# Altium schematic sheet DCDC_pump.SchDoc
size A4; SheetNumber: 5; SheetTotal: 5
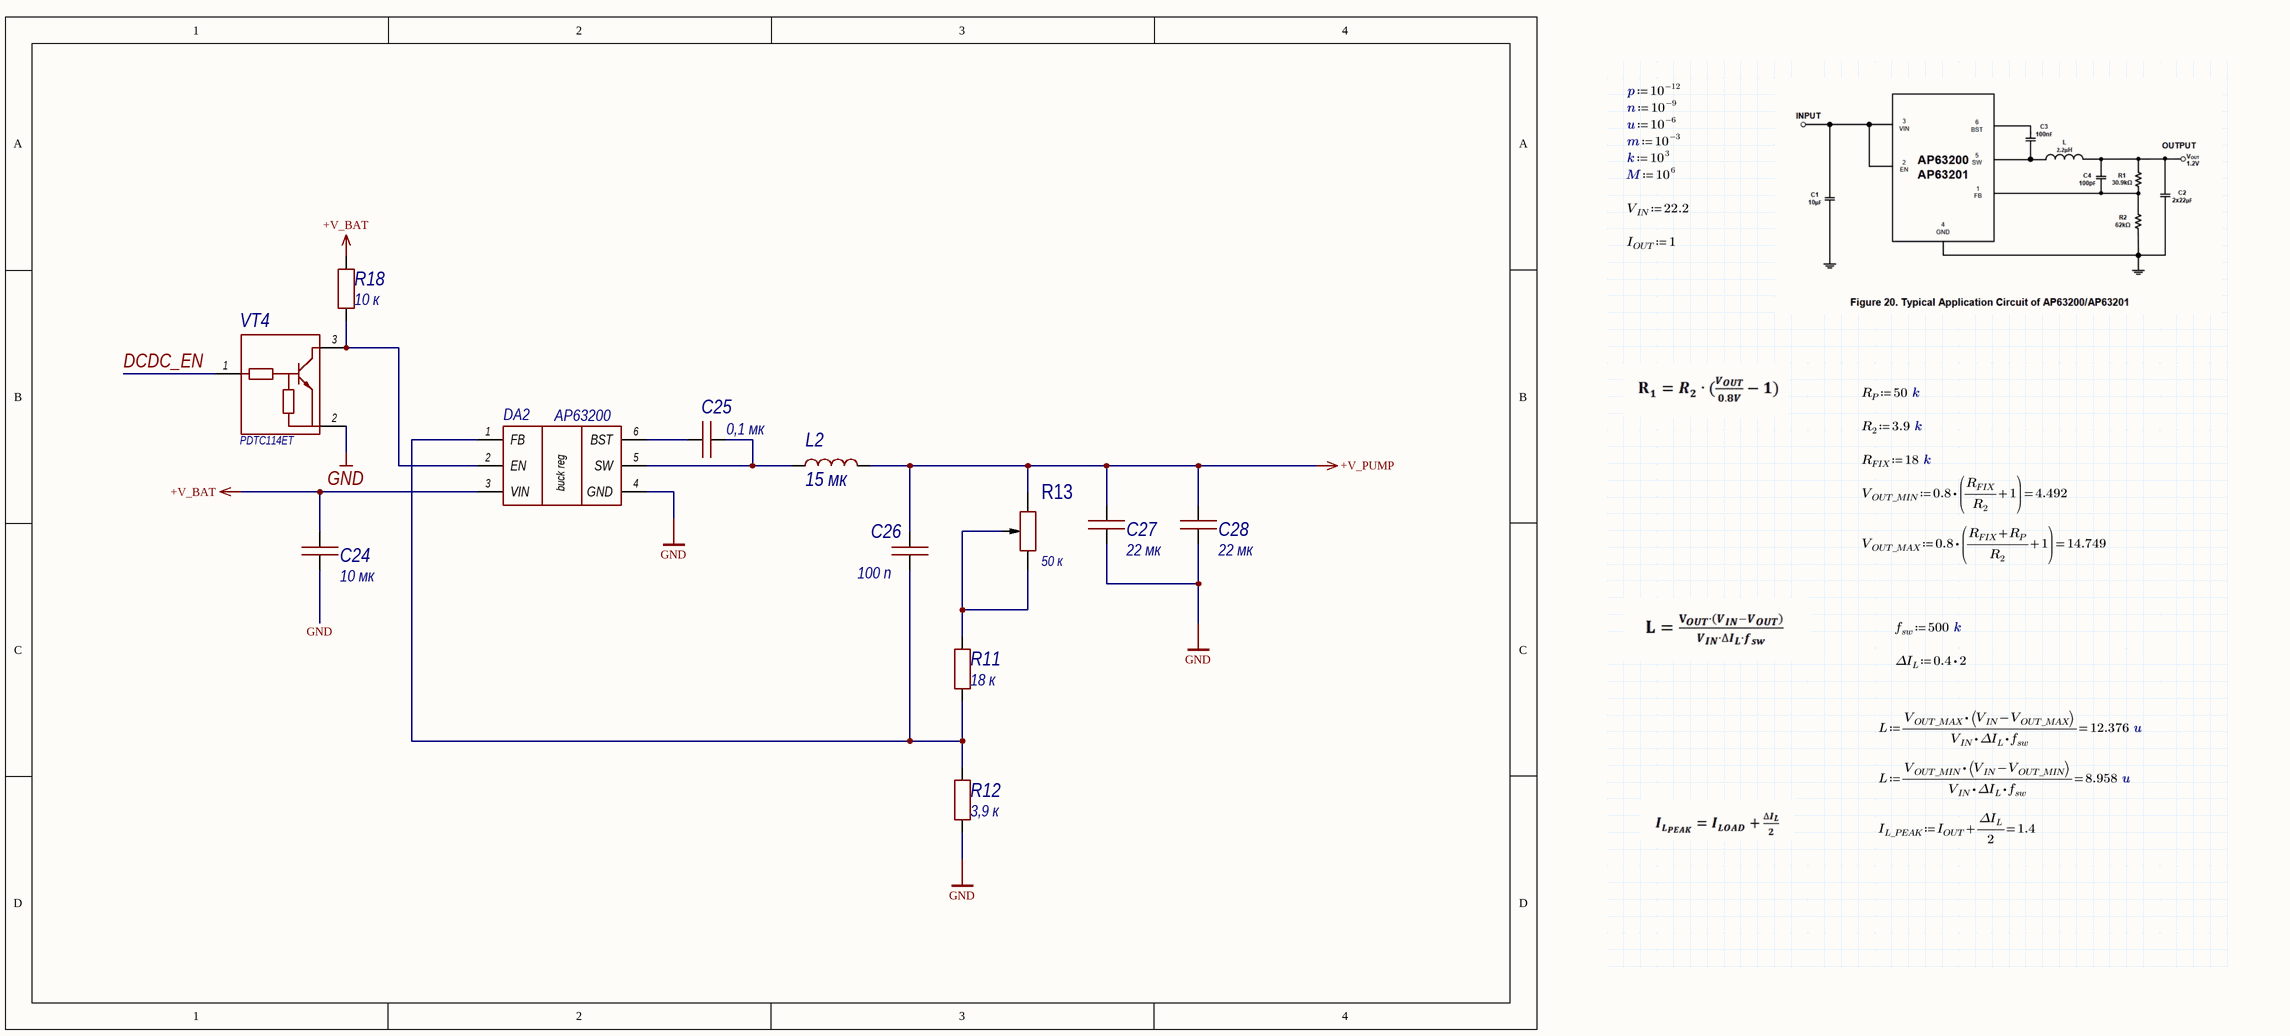
[diagram p0: DCDC_pump.SchDoc]

## Parts
C24  value 10 мк  [1210C]  (hidden comment: Capacitor)
C25  value 0,1 мк  [0603C]  (hidden comment: Capacitor)
C26  value 100 п  [0603C]  (hidden comment: Capacitor)
C27  value 22 мк  [1210C]  (hidden comment: Capacitor)
C28  value 22 мк  [1210C]  (hidden comment: Capacitor)
DA2  AP63200  [TSOT26]
L2  value 15 мк  [SP43]  (hidden comment: SP43-150K)
R11  value 18 к  [0603R]  (hidden comment: Resistor)
R12  value 3,9 к  [0603R]  (hidden comment: Resistor)
R13  value 50 к  [3mm_trim]  (hidden comment: TC33X-2-503E)
R18  value 10 к  [0603R]  (hidden comment: Resistor)
VT4  PDTC114ET  [SOT23-3]

## Nets
+V_BAT: C24.2 DA2.3(VIN) R18.2
+V_PUMP: C26.2 C27.2 C28.2 L2.2 R13.3
GND: C24.1 C27.1 C28.1 DA2.4(GND) R12.1 VT4.2(E)
DCDC_EN: VT4.1(B)
NetC25_1: C25.1 DA2.6(BST)
NetC25_2: C25.2 DA2.5(SW) L2.1
NetC26_1: C26.1 DA2.1(FB) R11.1 R12.2
NetDA2_2: DA2.2(EN) R18.1 VT4.3(C)
NetR11_2: R11.2 R13.1 R13.2

## Notes on the sheet
- (in symbol AP63200) buck reg

## Library data of the parts
C24 = Capacitor_10u_10_35V_X7R_1210C: Конденсатор; Library Path2: Schematic\Capacitor.SchLib; Tolerance: 0,1; Voltage (V): 35; Dielectric: X7R; Capacity (nF): 10000; Part Number: Capacitor_10u_10_35V_X7R_1210C
C25 = Capacitor_0,1u_10_50V_X7R_0603C: Конденсатор; Library Path2: Schematic\Capacitor.SchLib; Tolerance: 0,1; Voltage (V): 50; Dielectric: X7R; Capacity (nF): 100; Part Number: Capacitor_0,1u_10_50V_X7R_0603C
C26 = Capacitor_100p_10_50V_X7R_0603C: Конденсатор; Library Path2: Schematic\Capacitor.SchLib; Tolerance: 0,1; Voltage (V): 50; Dielectric: X7R; Part Number: Capacitor_100p_10_50V_X7R_0603C; Capacity (nF): 0,1
C27 C28 = Capacitor_22u_10_25V_X7R_1210C: Конденсатор; Library Path2: Schematic\Capacitor.SchLib; Tolerance: 0,1; Voltage (V): 25; Dielectric: X7R; Capacity (nF): 22000; Part Number: Capacitor_22u_10_25V_X7R_1210C
DA2 = AP63200: DC-DC понижающий преобразователь, Vin: 3.8 - 40 В, adj, 2 А; Part Number: AP63200
L2 = SP43-150K: Индуктивность на 15 мкГн, номинальный ток 1,3 А; Inductance (μH): 15; Current (A): 1,3; Part Number: SP43-150K
R11 = Resistor_18k_1_0603: Резистор номиналом 18 кОм и точностью 1%; Power: *; Part Number: Resistor_18k_1_0603; Tolerance: 1%
R12 = Resistor_3.9k_1_0603: Резистор номиналом 3,9 кОм и точностью 1%; Power: *; Part Number: Resistor_3.9k_1_0603; Tolerance: 1%
R13 = TC33X-2-503E: Потенциометр однооборотный керметный 50кОм 0.1Вт ±25% SMD лента на катушке; Tolerance: 50%; Part Number: TC33X-2-503E
R18 = Resistor_10k_1_0603: Резистор номиналом 10 кОм 1%; Power: *; Part Number: Resistor_10k_1_0603; Tolerance: 1%
VT4 = PDTC114ET: цифровой npn 50в 100мА; Current (A): 0, 1 А; Part Number: PDTC114ET; Voltage (V): 50 В